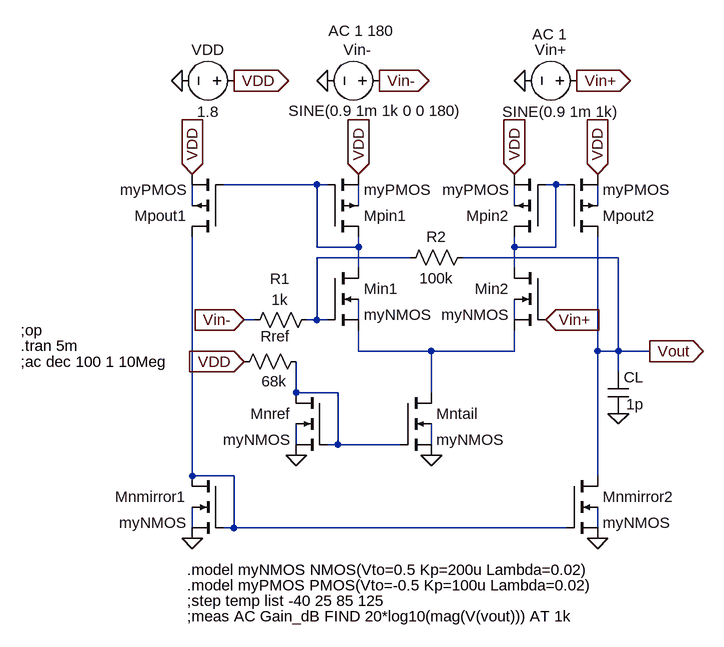
[diagram p0: schematic Symmetrical_OTA.asc]
Symmetrical_OTA.asc, the LTspice schematic file:
Version 4
SHEET 1 1952 888
WIRE 1104 208 960 208
WIRE 1120 208 1104 208
WIRE 1472 208 1456 208
WIRE 1488 208 1472 208
WIRE 912 240 912 208
WIRE 1168 240 1168 208
WIRE 1408 240 1408 208
WIRE 1536 240 1536 208
WIRE 1104 304 1104 208
WIRE 1168 304 1168 288
WIRE 1168 304 1104 304
WIRE 1408 304 1408 288
WIRE 1472 304 1472 208
WIRE 1472 304 1408 304
WIRE 1248 320 1104 320
WIRE 1568 320 1328 320
WIRE 1168 336 1168 304
WIRE 1408 336 1408 304
WIRE 1008 416 992 416
WIRE 1104 416 1104 320
WIRE 1104 416 1088 416
WIRE 1120 416 1104 416
WIRE 1168 416 1168 384
WIRE 1408 416 1408 384
WIRE 1168 464 1168 432
WIRE 1280 464 1168 464
WIRE 1408 464 1408 432
WIRE 1408 464 1280 464
WIRE 1536 464 1536 288
WIRE 1568 464 1568 320
WIRE 1568 464 1536 464
WIRE 1616 464 1568 464
WIRE 1568 496 1568 464
WIRE 1072 528 1072 480
WIRE 1136 528 1072 528
WIRE 1280 528 1280 464
WIRE 1072 608 1072 576
WIRE 1136 608 1136 528
WIRE 1136 608 1120 608
WIRE 1232 608 1136 608
WIRE 1280 608 1280 576
WIRE 912 656 912 288
WIRE 976 656 912 656
WIRE 1536 656 1536 464
WIRE 912 736 912 704
WIRE 976 736 976 656
WIRE 976 736 960 736
WIRE 1488 736 976 736
WIRE 1536 736 1536 704
FLAG 896 48 0
FLAG 976 48 VDD
IOPIN 976 48 Out
FLAG 1168 192 VDD
IOPIN 1168 192 In
FLAG 1408 192 VDD
IOPIN 1408 192 In
FLAG 912 192 VDD
IOPIN 912 192 In
FLAG 1536 192 VDD
IOPIN 1536 192 In
FLAG 1280 624 0
FLAG 1072 624 0
FLAG 912 752 0
FLAG 1536 752 0
FLAG 992 480 VDD
IOPIN 992 480 In
FLAG 1568 560 0
FLAG 1616 464 Vout
IOPIN 1616 464 Out
FLAG 1120 48 0
FLAG 1424 48 0
FLAG 1504 48 Vin+
IOPIN 1504 48 Out
FLAG 1200 48 Vin-
IOPIN 1200 48 Out
FLAG 1456 416 Vin+
IOPIN 1456 416 In
FLAG 992 416 Vin-
IOPIN 992 416 In
SYMBOL nmos4 1120 336 R0
SYMATTR InstName Min1
SYMATTR Value myNMOS
SYMATTR Value2 l=1u w=2u
SYMBOL nmos4 1456 336 M0
SYMATTR InstName Min2
SYMATTR Value myNMOS
SYMATTR Value2 l=1u w=2u
SYMBOL pmos4 1120 288 M180
SYMATTR InstName Mpin1
SYMATTR Value myPMOS
SYMATTR Value2 l=1u w=4u
SYMBOL pmos4 1456 288 R180
SYMATTR InstName Mpin2
SYMATTR Value myPMOS
SYMATTR Value2 l=1u w=4u
SYMBOL voltage 992 48 R90
WINDOW 0 -32 56 VBottom 2
WINDOW 3 32 56 VTop 2
SYMATTR InstName VDD
SYMATTR Value 1.8
SYMBOL pmos4 960 288 R180
SYMATTR InstName Mpout1
SYMATTR Value myPMOS
SYMATTR Value2 l=1u w=4u
SYMBOL pmos4 1488 288 M180
SYMATTR InstName Mpout2
SYMATTR Value myPMOS
SYMATTR Value2 l=1u w=4u
SYMBOL nmos4 1232 528 R0
SYMATTR InstName Mntail
SYMATTR Value myNMOS
SYMATTR Value2 l=1u w=4u
SYMBOL nmos4 1120 528 M0
SYMATTR InstName Mnref
SYMATTR Value myNMOS
SYMATTR Value2 l=1u w=4u
SYMBOL nmos4 960 656 M0
SYMATTR InstName Mnmirror1
SYMATTR Value myNMOS
SYMATTR Value2 l=1u w=2u
SYMBOL nmos4 1488 656 R0
SYMATTR InstName Mnmirror2
SYMATTR Value myNMOS
SYMATTR Value2 l=1u w=2u
SYMBOL res 976 496 R270
WINDOW 0 39 64 VTop 2
WINDOW 3 1 62 VBottom 2
SYMATTR InstName Rref
SYMATTR Value 68k
SYMBOL cap 1552 496 R0
WINDOW 3 28 50 Left 2
SYMATTR Value 1p
SYMATTR InstName CL
SYMBOL voltage 1520 48 R90
WINDOW 0 -32 56 VBottom 2
WINDOW 3 32 41 VTop 2
WINDOW 123 -87 58 VTop 2
WINDOW 39 0 0 Left 0
SYMATTR InstName Vin+
SYMATTR Value SINE(0.9 1m 1k)
SYMATTR Value2 AC 1
SYMBOL voltage 1216 48 R90
WINDOW 0 -63 50 VTop 2
WINDOW 3 62 23 VBottom 2
WINDOW 123 -61 44 VBottom 2
WINDOW 39 0 0 Left 0
SYMATTR InstName Vin-
SYMATTR Value SINE(0.9 1m 1k 0 0 180)
SYMATTR Value2 AC 1 180
SYMBOL res 1104 400 R90
WINDOW 0 -32 57 VBottom 2
WINDOW 3 -31 57 VTop 2
SYMATTR InstName R1
SYMATTR Value 1k
SYMBOL res 1344 304 R90
WINDOW 0 0 56 VBottom 2
WINDOW 3 32 56 VTop 2
SYMATTR InstName R2
SYMATTR Value 100k
TEXT 904 800 Left 2 !.model myNMOS NMOS(Vto=0.5 Kp=200u Lambda=0.02)
TEXT 904 824 Left 2 !.model myPMOS PMOS(Vto=-0.5 Kp=100u Lambda=0.02)
TEXT 648 432 Left 2 !;op
TEXT 648 456 Left 2 !.tran 5m
TEXT 648 480 Left 2 !;ac dec 100 1 10Meg
TEXT 904 848 Left 2 !;step temp list -40 25 85 125
TEXT 904 872 Left 2 !;meas AC Gain_dB FIND 20*log10(mag(V(vout))) AT 1k

The netlist it stands for:
* Symmetrical_OTA.asc
Min1 N001 N007 N010 N008 myNMOS l=1u w=2u
Min2 N002 Vin+ N010 N009 myNMOS l=1u w=2u
Mpin1 N001 N001 VDD N004 myPMOS l=1u w=4u
Mpin2 N002 N002 VDD N005 myPMOS l=1u w=4u
VDD VDD 0 1.8
Mpout1 N014 N001 VDD N003 myPMOS l=1u w=4u
Mpout2 Vout N002 VDD N006 myPMOS l=1u w=4u
Mntail N010 N011 0 N013 myNMOS l=1u w=4u
Mnref N011 N011 0 N012 myNMOS l=1u w=4u
Mnmirror1 N014 N014 0 N015 myNMOS l=1u w=2u
Mnmirror2 Vout N014 0 N016 myNMOS l=1u w=2u
Rref VDD N011 68k
CL Vout 0 1p
Vin+ Vin+ 0 SINE(0.9 1m 1k) AC 1
Vin- Vin- 0 SINE(0.9 1m 1k 0 0 180) AC 1 180
R1 N007 Vin- 1k
R2 Vout N007 100k
.model NMOS NMOS
.model PMOS PMOS
.lib standard.mos
.model myNMOS NMOS(Vto=0.5 Kp=200u Lambda=0.02)
.model myPMOS PMOS(Vto=-0.5 Kp=100u Lambda=0.02)
;op
.tran 5m
;ac dec 100 1 10Meg
;step temp list -40 25 85 125
;meas AC Gain_dB FIND 20*log10(mag(V(vout))) AT 1k
.backanno
.end